# Altium project Juno_Light_Central.PrjPcb
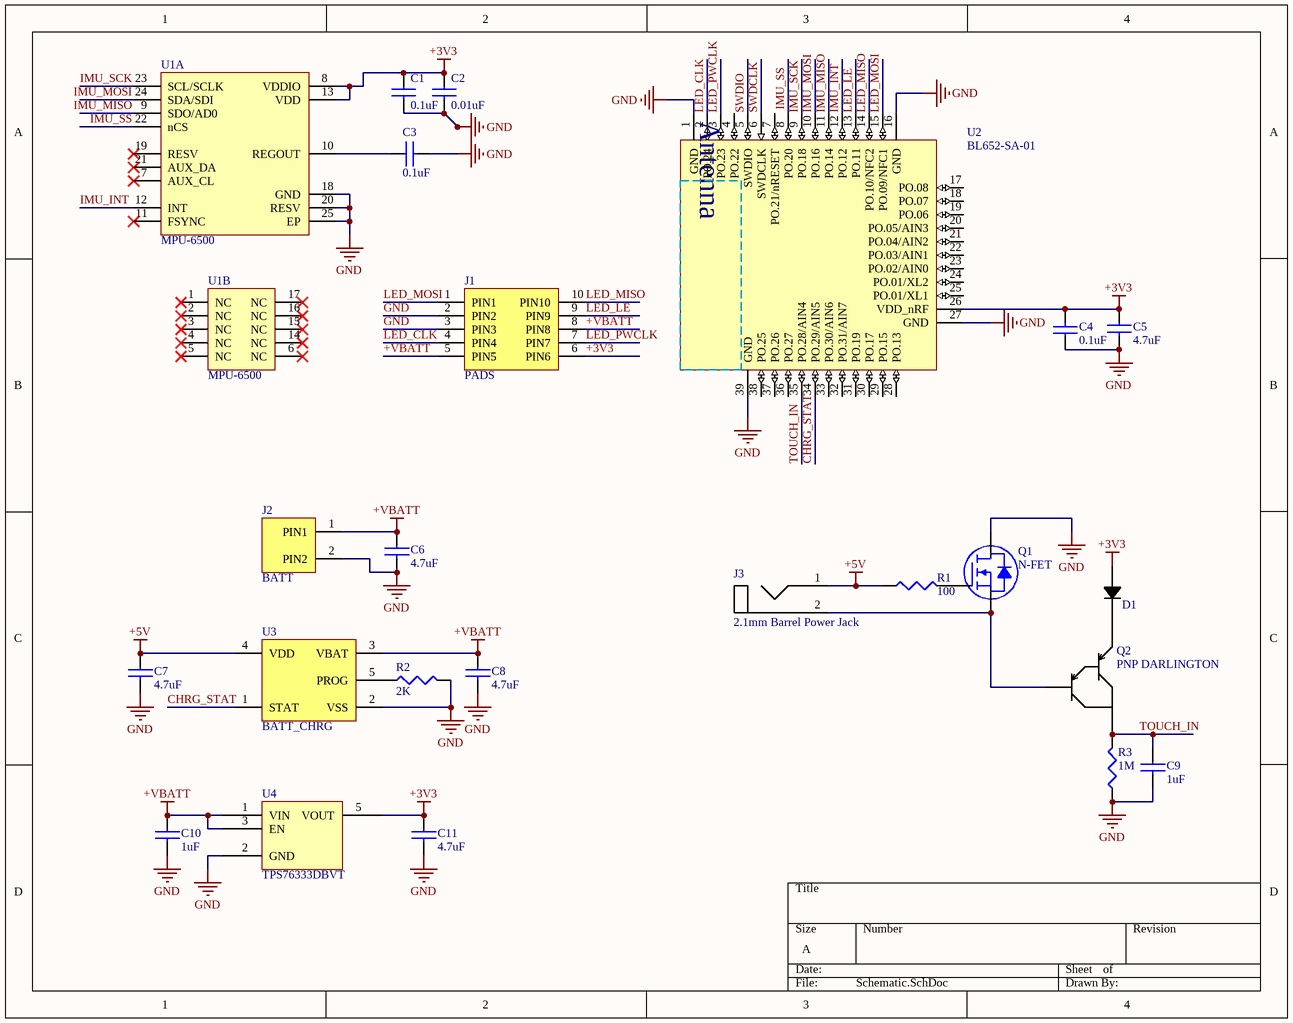
[diagram p0: Schematic.SchDoc]
1 sheet, 24 parts. Net scope: global (net labels, ports and power ports of the same name join across sheets).
Board file: Juno_Light_Central.PcbDoc

## Sheet Schematic.SchDoc
size A

### Parts
C1  0.1uF  [C0402]
C2  0.01uF  [C0402]
C3  0.1uF  [C0402]
C4  0.1uF  [C0402]
C5  4.7uF  [C0603]
C6  4.7uF  [C0603]
C7  4.7uF  [C0603]
C8  4.7uF  [C0603]
C9  1uF  [C0402]
C10  1uF  [C0402]
C11  4.7uF  [C0603]
D1  1N4148X-TP  [SOD-523]  (value not drawn)
J1  PADS  [Pads]
J2  BATT  [S2B-PH-K-S]
J3  2.1mm Barrel Power Jack  [2.1mm Power Jack]
Q1  N-FET  [SOT-23-3]
Q2  PNP DARLINGTON  [SOT-23-3]
R1  100  [R0402]
R2  2K  [R0402]
R3  1M  [R0402]
U1  MPU-6500  [QFN-24]  (parts A,B of 2)
U2  BL652-SA-01  [BL652-SA-01]
U3  BATT_CHRG  [SOT-23-5]
U4  TPS76333DBVT  [SOT-23-5]

### Nets
+3V3: C1.1 C2.1 C4.2 C5.1 C11.1 D1.2 J1.6(PIN6) U1.8(VDDIO) U1.13(VDD) U2.26(VDD_nRF) U4.5(VOUT)
+5V: C7.1 J3.1(+) R1.1 U3.4(VDD)
+VBATT: C6.1 C8.1 C10.1 J1.5(PIN5) J1.8(PIN8) J2.1(PIN1) U3.3(VBAT) U4.1(VIN) U4.3(EN)
GND: C1.2 C2.2 C3.2 C4.1 C5.2 C6.2 C7.2 C8.2 C9.2 C10.2 C11.2 J1.2(PIN2) J1.3(PIN3) J2.2(PIN2) Q1.3(D) R2.2 R3.1 U1.18(GND) U1.20(RESV) U1.25(EP) U2.1(GND) U2.16(GND) U2.27(GND) U2.39(GND) U3.2(VSS) U4.2(GND)
CHRG_STAT: U2.34(PO.29/AIN5) U3.1(STAT)
IMU_INT: U1.12(INT) U2.12(PO.12)
IMU_MISO: U1.9(SDO/AD0) U2.11(PO.14)
IMU_MOSI: U1.24(SDA/SDI) U2.10(PO.16)
IMU_SCK: U1.23(SCL/SCLK) U2.9(PO.18)
IMU_SS: U1.22(nCS) U2.8(PO.20)
LED_CLK: J1.4(PIN4) U2.2(PO.24)
LED_LE: J1.9(PIN9) U2.13(PO.11)
LED_MISO: J1.10(PIN10) U2.14(PO.10/NFC2)
LED_MOSI: J1.1(PIN1) U2.15(PO.09/NFC1)
LED_PWCLK: J1.7(PIN7) U2.3(PO.23)
SWDCLK: U2.6(SWDCLK)
SWDIO: U2.5(SWDIO)
TOUCH_IN: C9.1 Q2.3 R3.2 U2.35(PO.28/AIN4)
NetC3_1: C3.1 U1.10(REGOUT)
NetD1_1: D1.1 Q2.2
NetJ3_2: J3.2(+) Q1.2(S) Q2.1(B)
NetQ1_1: Q1.1(G) R1.2
NetR2_1: R2.1 U3.5(PROG)

Not connected (* = marked no-connect by the designer): U1 1(NC)* 2(NC)* 3(NC)* 4(NC)* 5(NC)* 6(NC)* 7(AUX_CL)* 11(FSYNC)* 14(NC)* 15(NC)* 16(NC)* 17(NC)* 19(RESV)* 21(AUX_DA)*; U2 4(PO.22) 7(PO.21/nRESET) 17(PO.08) 18(PO.07) 19(PO.06) 20(PO.05/AIN3) 21(PO.04/AIN2) 22(PO.03/AIN1) 23(PO.02/AIN0) 24(PO.01/XL2) 25(PO.01/XL1) 28(PO.13) 29(PO.15) 30(PO.17) 31(PO.19) 32(PO.31/AIN7) 33(PO.30/AIN6) 36(PO.27) 37(PO.26) 38(PO.25)

### Notes on the sheet
- (in symbol BL652-SA-01-T/R) Antenna

### Library data of the parts
C1 C3 C4 = CL05B104KO5NNNC: Cap Ceramic 0.1uF 16V X7R 10% SMD 0402 125C C/T; Manufacturer 1: Samsung; Description 1: Cap Ceramic 0.1uF 16V X7R 10% SMD 0402 125C Paper T/R; Capacitance: 100nF; Supplier 1: Digi-Key; Supplier Part Number 1: 1276-1001-6-ND; Manufacturer Part Number 1: CL05B104KO5NNNC; Stock 1: 9531; Pricing 1: 1=0.1, 10=0.018, 100=0.0081, 500=0.0058, 1000=0.0045, 2500=0.0041, 5000=0.0038 (USD); Mount: Surface Mount; Case/Package: 0402; Case Code (Metric): 1005; Case Code (Imperial): 0402; Material: Ceramic; Contact Plating: Tin; Min Operating Temperature: -55°C; Max Operating Temperature: 125°C; Tolerance: 10%; Package Quantity: 1; Packaging: Tape and Reel; Voltage Rating: 16V; Dielectric: X7R; Voltage: 16V; Voltage Rating (DC): 16V; Length: 1mm; Height: 0.5mm; Width: 0.02inch; Thickness: 0.022inch; Depth: 0.5mm; Radiation Hardening: No; Lead Free: Lead Free; ComponentLink1URL: https://datasheet.ciiva.com/16208/cl05b104kq5nnnc-16208343.pdf; ComponentLink1Description: https://datasheet.ciiva.com/16208/cl05b104kq5nnnc-16208343.pdf; ComponentLink2URL: https://datasheet.ciiva.com/26920/getdatasheetpartid-359683-26920169.pdf; ComponentLink2Description: https://datasheet.ciiva.com/26920/getdatasheetpartid-359683-26920169.pdf; ComponentLink3URL: https://datasheet.ciiva.com/26309/mlcc-catalogdownload2013-eng-26309003.pdf; ComponentLink3Description: https://datasheet.ciiva.com/26309/mlcc-catalogdownload2013-eng-26309003.pdf; ComponentLink4URL: https://datasheet.ciiva.com/29198/458718-da-01-en-vs-kondensator-0402-29198423.pdf; ComponentLink4Description: https://datasheet.ciiva.com/29198/458718-da-01-en-vs-kondensator-0402-29198423.pdf
C2 = GRM155R71E103KA01D: CAP CER 10000PF 25V X7R 0402; Manufacturer: Murata; Material: Ceramic; Capacitance: 10nF; Tolerance: 10%; Insulation Resistance: 10GR; Supplier 1: Digi-Key; Supplier Part Number 1: 490-1312-1-ND; Manufacturer Part Number: GRM155R71E103KA01D; Stock 1: 100000; Pricing 1: 1=0.1, 10=0.03, 100=0.0134, 500=0.00958, 1000=0.00753, 2500=0.00684, 5000=0.0063 (USD); Mount: Surface Mount; Case/Package: 0402; Number of Pins: 2; Case Code (Imperial): 0402; Case Code (Metric): 1005; Dielectric Material: Ceramic; Min Operating Temperature: -55°C; Max Operating Temperature: 125°C; Packaging: Tape and Reel; Voltage Rating: 25V; Voltage Rating (DC): 25V; Package Quantity: 1; Dielectric: X7R; Termination: SMD/SMT; Voltage: 25V; Length: 1mm; Height: 0.5mm; Width: 0.5mm; Thickness: 0.022inch; Depth: 0.5mm; Radiation Hardening: No; REACH SVHC: No SVHC; Lead Free: Lead Free; ComponentLink1URL: https://datasheet.ciiva.com/11786/0900766b807a1cab-11786320.pdf; ComponentLink1Description: https://datasheet.ciiva.com/11786/0900766b807a1cab-11786320.pdf; ComponentLink2URL: https://datasheet.ciiva.com/18184/getdatasheetpartid-161489-18184689.pdf; ComponentLink2Description: https://datasheet.ciiva.com/18184/getdatasheetpartid-161489-18184689.pdf; ComponentLink3URL: https://datasheet.ciiva.com/28534/1699889-28534148.pdf; ComponentLink3Description: https://datasheet.ciiva.com/28534/1699889-28534148.pdf; ComponentLink4URL: https://datasheet.ciiva.com/7937/1747448-7937621.pdf; ComponentLink4Description: https://datasheet.ciiva.com/7937/1747448-7937621.pdf; ComponentLink5URL: https://datasheet.ciiva.com/16199/product-16199034.pdf; ComponentLink5Description: https://datasheet.ciiva.com/16199/product-16199034.pdf; ComponentLink6URL: https://datasheet.ciiva.com/3777/3813grm155r71e103ka0123-3777115.pdf; ComponentLink6Description: https://datasheet.ciiva.com/3777/3813grm155r71e103ka0123-3777115.pdf; ComponentLink7URL: https://datasheet.ciiva.com/129/partnumbering-e-01-129741.pdf; ComponentLink7Description: https://datasheet.ciiva.com/129/partnumbering-e-01-129741.pdf; ComponentLink8URL: https://datasheet.ciiva.com/129/partnumbering-e-01-129742.pdf; ComponentLink8Description: https://datasheet.ciiva.com/129/partnumbering-e-01-129742.pdf; ComponentLink9URL: https://datasheet.ciiva.com/129/partnumbering-e-01-129743.pdf; ComponentLink9Description: https://datasheet.ciiva.com/129/partnumbering-e-01-129743.pdf; ComponentLink10URL: https://datasheet.ciiva.com/29199/454154-da-01-en-vs-kondensator-0402-29199817.pdf; ComponentLink10Description: https://datasheet.ciiva.com/29199/454154-da-01-en-vs-kondensator-0402-29199817.pdf
C5-C8 C11 = CC0603KRX5R6BB475: 4.7µF ±10% 10V X5R Ceramic Capacitor -55°C ~ 85°C Surface Mount, MLCC 0603 (1608 Metric) 0.063" L x 0.031" W (1.60mm x 0.80mm); Manufacturer 1: Yageo; Supplier 1: Digi-Key; Supplier Part Number 1: 311-1455-6-ND; Manufacturer Part Number 1: CC0603KRX5R6BB475; Description 1: 4.7µF ±10% 10V X5R Ceramic Capacitor -55°C ~ 85°C Surface Mount, MLCC 0603 (1608 Metric) 0.063" L x 0.031" W (1.60mm x 0.80mm); Stock 1: 166715; Pricing 1: 1=0.16, 10=0.115, 100=0.0543, 500=0.0381, 1000=0.0315 (USD); Mount: Surface Mount; Case/Package: 0603; Case Code (Imperial): 0603; Case Code (Metric): 1608; Min Operating Temperature: -55°C; Max Operating Temperature: 85°C; Capacitance: 4.7uF; Voltage Rating: 10V; Voltage Rating (DC): 10V; Tolerance: 10%; Packaging: Tape and Reel; Package Quantity: 1; Dielectric: X5R; Termination: SMD/SMT; Composition: Ceramic; Length: 1.6mm; Height: 0.8mm; Width: 0.8mm; Thickness: 0.035inch; Depth: 0.8mm; Radiation Hardening: No; REACH SVHC: Unknown; Lead Free: Lead Free; Halogen Free: Halogen Free; ComponentLink1URL: https://datasheet.ciiva.com/8033/1525783-8033798.pdf; ComponentLink1Description: https://datasheet.ciiva.com/8033/1525783-8033798.pdf; ComponentLink2URL: https://datasheet.ciiva.com/179/mlccorderingcode-179704.pdf; ComponentLink2Description: https://datasheet.ciiva.com/179/mlccorderingcode-179704.pdf; ComponentLink3URL: https://datasheet.ciiva.com/179/mlccorderingcode-179705.pdf; ComponentLink3Description: https://datasheet.ciiva.com/179/mlccorderingcode-179705.pdf; ComponentLink4URL: https://datasheet.ciiva.com/179/mlccorderingcode-179706.pdf; ComponentLink4Description: https://datasheet.ciiva.com/179/mlccorderingcode-179706.pdf; ComponentLink5URL: https://datasheet.ciiva.com/8033/1525783-8033802.pdf; ComponentLink5Description: https://datasheet.ciiva.com/8033/1525783-8033802.pdf; ComponentLink6URL: https://datasheet.ciiva.com/11586/upy-gphc-x5r-4v-to-50v-12-11586314.pdf; ComponentLink6Description: https://datasheet.ciiva.com/11586/upy-gphc-x5r-4v-to-50v-12-11586314.pdf; ComponentLink7URL: https://datasheet.ciiva.com/16623/upy-gphc-x5r-4v-to-50v-12-16623983.pdf; ComponentLink7Description: https://datasheet.ciiva.com/16623/upy-gphc-x5r-4v-to-50v-12-16623983.pdf
C9 C10 = CL05A105MP5NNNC: Cap Ceramic 1uF 10V X5R 20% SMD 0402 85C C/T; Manufacturer 1: Samsung; Description 1: Cap Ceramic 1uF 10V X5R 20% SMD 0402 85C Paper T/R; Supplier 1: Digi-Key; Supplier Part Number 1: 1276-1448-6-ND; Manufacturer Part Number 1: CL05A105MP5NNNC; Stock 1: 42775; Pricing 1: 1=0.1, 10=0.028, 100=0.0124, 500=0.0089, 1000=0.007, 2500=0.0063, 5000=0.0058 (USD); Mount: Surface Mount; Case/Package: 0402; Case Code (Metric): 1005; Case Code (Imperial): 0402; Min Operating Temperature: -55°C; Max Operating Temperature: 85°C; Package Quantity: 1; Packaging: Tape and Reel; Capacitance: 1uF; Tolerance: 20%; Voltage Rating: 10V; Dielectric: X5R; Voltage Rating (DC): 10V; Length: 1mm; Height: 0.5mm; Width: 0.02inch; Thickness: 0.022inch; Depth: 0.5mm; Radiation Hardening: No; Lead Free: Lead Free; ComponentLink1URL: https://datasheet.ciiva.com/25802/cl05a105mp5nnnc-25802049.pdf; ComponentLink1Description: https://datasheet.ciiva.com/25802/cl05a105mp5nnnc-25802049.pdf
D1 = 1N4148X-TP: Manufacturer 1: MCC; Max Surge Current: 2A; Recovery Time: 4ns; Forward Voltage: 1.25V; Forward Current: 300mA; Average Rectified Current: 150mA; Max Reverse Leakage Current: 1uA; Power Dissipation: 200mW; Max Repetitive Reverse Voltage (Vrrm): 100V; Element Configuration: Single; Polarity: Standard; Voltage Rating (DC): 75V; Capacitance: 2pF; Supplier 1: Digi-Key; Supplier Part Number 1: 1N4148XTPMSCT-ND; Manufacturer Part Number 1: 1N4148X-TP; Stock 1: 2136057; Pricing 1: 1=0.14, 10=0.125, 100=0.0815, 500=0.03986, 1000=0.02718 (USD); Mount: Surface Mount; Number of Pins: 2; Min Operating Temperature: -65°C; Max Operating Temperature: 150°C; Package Quantity: 1; Packaging: Tape and Reel; Reverse Recovery Time: 4ns; Peak Non-Repetitive Surge Current: 2A; Current Rating: 150mA; Output Current: 300mA; Max Reverse Voltage (DC): 75V; Radiation Hardening: No; Lead Free: Lead Free; ComponentLink1URL: http://www.mccsemi.com/up_pdf/1N4148X(SOD-523).PDF?src-supplier=Digi-Key; ComponentLink1Description: http://www.mccsemi.com/up_pdf/1N4148X(SOD-523).PDF?src-supplier=Digi-Key; ComponentLink2URL: http://www.mouser.com/ds/2/258/1N4148X(SOD-523)-349105.pdf?src-supplier=Mouser; ComponentLink2Description: http://www.mouser.com/ds/2/258/1N4148X(SOD-523)-349105.pdf?src-supplier=Mouser; ComponentLink3URL: http://www.mccsemi.com/up_pdf/1N4148X(SOD-523).PDF?src-supplier=Future+Electronics; ComponentLink3Description: http://www.mccsemi.com/up_pdf/1N4148X(SOD-523).PDF?src-supplier=Future+Electronics
J2 = S2B-PH-K-S(LF)(SN): CONN HEADER R/A 2POS 2MM; Manufacturer 1: JST; Current Rating: 2A; Contact Resistance: 20mR; Voltage Rating: 100V; Number of Positions: 2; Gender: Male; Connector Type: Male Pin; Insulation Resistance: 1GR; Supplier 1: Digi-Key; Supplier Part Number 1: 455-1719-ND; Manufacturer Part Number 1: S2B-PH-K-S(LF)(SN); Stock 1: 161668; Pricing 1: 1=0.17, 10=0.161, 100=0.0991, 500=0.08202, 1000=0.07177, 5000=0.06152, 10000=0.05981 (USD); Mount: Through Hole; Number of Pins: 2; Contact Material: Tin,Brass,Bronze; Contact Plating: Tin,Copper; Color: Natural,White; Housing Color: White; Housing Material: Polyamide; Min Operating Temperature: -25°C; Max Operating Temperature: 85°C; Max Current Rating: 2A; Number of Rows: 1; Packaging: Bulk; Termination: Solder; Fastening Type: Detent; Number of Contacts: 2; Max Voltage Rating (AC): 100V; Orientation: Right Angle; Number of Poles: 2; Voltage Rating (AC): 100V; Max Voltage Rating (DC): 100V; Working Voltage: 100V; Length: 5.9mm; Height: 9.4mm; Pitch: 2mm; Width: 4.5mm; Contact Mating Length: 0.13inch; Depth: 7.6mm; Lead Pitch: 2mm; REACH SVHC: No SVHC; Lead Free: Lead Free; Flammability Rating: UL94 V-0; ComponentLink1URL: http://www1.futureelectronics.com/doc/JST/S2B-PH-K-S(LF)(SN).pdf?src-supplier=Future+Electronics; ComponentLink1Description: http://www1.futureelectronics.com/doc/JST/S2B-PH-K-S(LF)(SN).pdf?src-supplier=Future+Electronics; ComponentLink2URL: https://www.verical.com/server-webapp/html/getDatasheet?partID=641020&src-supplier=Verical; ComponentLink2Description: https://www.verical.com/server-webapp/html/getDatasheet?partID=641020&src-supplier=Verical; ComponentLink3URL: http://www.jst-mfg.com/product/pdf/eng/ePH.pdf?src-supplier=Digi-Key; ComponentLink3Description: http://www.jst-mfg.com/product/pdf/eng/ePH.pdf?src-supplier=Digi-Key; ComponentLink4URL: http://www.farnell.com/datasheets/80564.pdf?src-supplier=Element14; ComponentLink4Description: http://www.farnell.com/datasheets/80564.pdf?src-supplier=Element14
J3 = 2.1mm Barrel Power Jack: 2.1mm Barrel Power Jack Panel Mount
Q1 = NDS331N: MOSFET N-CH 20V 1.3A SSOT3; Manufacturer 1: ON Semiconductor / Fairchild; Nominal Vgs: 700mV; Rds On Max: 160mR; Input Capacitance: 162pF; Rise Time: 25ns; Max Power Dissipation: 500mW; Number of Elements: 1; Gate to Source Voltage (Vgs): 8V; Fall Time: 5ns; Drain to Source Resistance: 210mR; Turn-Off Delay Time: 10ns; Element Configuration: Single; Supplier 1: Digi-Key; Supplier Part Number 1: NDS331NCT-ND; Manufacturer Part Number 1: NDS331N; Stock 1: 114658; Pricing 1: 1=0.44, 10=0.349, 100=0.2395, 500=0.16424, 1000=0.12318 (USD); Mount: Surface Mount; Case/Package: TO-236-3; Number of Pins: 3; Weight: 0.03g; Min Operating Temperature: -55°C; Max Operating Temperature: 150°C; Package Quantity: 1; Packaging: Tape and Reel; Drain to Source Voltage (Vdss): 20V; Continuous Drain Current (ID): 1.3A; Drain to Source Breakdown Voltage: 20V; Power Dissipation: 500mW; Threshold Voltage: 700mV; Turn-On Delay Time: 5ns; Voltage Rating (DC): 20V; Current Rating: 1.3A; On-State Resistance: 160mR; Length: 2.92mm; Height: 0.94mm; Width: 1.4mm; Radiation Hardening: No; REACH SVHC: No SVHC; Lead Free: Lead Free; ComponentLink1URL: http://www.farnell.com/datasheets/2303897.pdf?src-supplier=Newark; ComponentLink1Description: http://www.farnell.com/datasheets/2303897.pdf?src-supplier=Newark; ComponentLink2URL: http://www.farnell.com/datasheets/195775.pdf?src-supplier=Element14; ComponentLink2Description: http://www.farnell.com/datasheets/195775.pdf?src-supplier=Element14; ComponentLink3URL: https://www.verical.com/server-webapp/html/getDatasheet?partID=110520&src-supplier=Verical; ComponentLink3Description: https://www.verical.com/server-webapp/html/getDatasheet?partID=110520&src-supplier=Verical; ComponentLink4URL: http://www.jameco.com/Jameco/Products/ProdDS/1030703.pdf?src-supplier=Jameco; ComponentLink4Description: http://www.jameco.com/Jameco/Products/ProdDS/1030703.pdf?src-supplier=Jameco; ComponentLink5URL: http://www.mouser.com/ds/2/149/NDS331N-116501.pdf?src-supplier=Mouser; ComponentLink5Description: http://www.mouser.com/ds/2/149/NDS331N-116501.pdf?src-supplier=Mouser; ComponentLink6URL: https://www.fairchildsemi.com/datasheets/ND/NDS331N.pdf?src-supplier=Avnet; ComponentLink6Description: https://www.fairchildsemi.com/datasheets/ND/NDS331N.pdf?src-supplier=Avnet; ComponentLink7URL: http://www.fairchildsemi.com/ds/ND/NDS331N.pdf?src-supplier=Avnet+Europe; ComponentLink7Description: http://www.fairchildsemi.com/ds/ND/NDS331N.pdf?src-supplier=Avnet+Europe
Q2 = MMBTA63LT1G: Manufacturer 1: ON Semiconductor; Collector Emitter Voltage (VCEO): 30V; hFE Min: 5000; Number of Elements: 1; Max Power Dissipation: 225mW; Max Collector Current: 500mA; Transition Frequency: 125MHz; Emitter Base Voltage (VEBO): 10V; Collector Emitter Saturation Voltage: 1.5V; Element Configuration: Single; Continuous Collector Current: -500mA; Voltage Rating (DC): -30V; Supplier 1: Digi-Key; Supplier Part Number 1: MMBTA63LT1GOSCT-ND; Manufacturer Part Number 1: MMBTA63LT1G; Stock 1: 102027; Pricing 1: 1=0.22, 10=0.203, 100=0.1106, 500=0.06806, 1000=0.0464 (USD); Case/Package: SOT-23-3; Number of Pins: 3; Weight: 0.01lb; Contact Plating: Tin,Matte; Min Operating Temperature: -55°C; Max Operating Temperature: 150°C; Package Quantity: 1; Packaging: Tape and Reel; Collector Emitter Breakdown Voltage: 30V; Max Breakdown Voltage: 30V; Polarity: PNP; Collector Base Voltage (VCBO): 30V; Power Dissipation: 225mW; Current Rating: -500mA; Length: 3.04mm; Height: 1.01mm; Width: 1.4mm; Radiation Hardening: No; REACH SVHC: No SVHC; Lead Free: Lead Free; Halogen Free: Halogen Free; ComponentLink1URL: http://www.onsemi.com/pub/Collateral/MMBTA63LT1-D.PDF?src-supplier=Avnet; ComponentLink1Description: http://www.onsemi.com/pub/Collateral/MMBTA63LT1-D.PDF?src-supplier=Avnet; ComponentLink2URL: http://www.onsemi.com/pub/Collateral/MMBTA63LT1-D.PDF?src-supplier=Digi-Key; ComponentLink2Description: http://www.onsemi.com/pub/Collateral/MMBTA63LT1-D.PDF?src-supplier=Digi-Key; ComponentLink3URL: http://www.onsemi.com/pub/Collateral/MMBTA63LT1-D.PDF?src-supplier=Future+Electronics; ComponentLink3Description: http://www.onsemi.com/pub/Collateral/MMBTA63LT1-D.PDF?src-supplier=Future+Electronics; ComponentLink4URL: http://www.jameco.com/Jameco/Products/ProdDS/2011408.pdf?src-supplier=Jameco; ComponentLink4Description: http://www.jameco.com/Jameco/Products/ProdDS/2011408.pdf?src-supplier=Jameco
R1 = ERJ-2GEJ101X: Res Thick Film 0402 100 Ohm 5% 0.1W(1/10W) ±200ppm/C Molded SMD Automotive T/R; Manufacturer 1: Panasonic ECG; Resistance: 100R; Temperature Coefficient: 200ppm/°C; Power Rating: 100mW; Voltage Rating: 50V; Supplier 1: Digi-Key; Supplier Part Number 1: P100JDKR-ND; Manufacturer Part Number 1: ERJ-2GEJ101X; Description 1: Res Thick Film 0402 100 Ohm 5% 0.1W(1/10W) ±200ppm/C Molded SMD Automotive T/R; Stock 1: 1981514; Pricing 1: 1=0.1, 10=0.029, 100=0.0117, 1000=0.0053, 2500=0.0046, 5000=0.0038 (USD); Mount: Surface Mount; Case/Package: 0402; Contact Plating: Tin; Case Code (Imperial): 0402; Case Code (Metric): 1005; Min Operating Temperature: -55°C; Max Operating Temperature: 155°C; Tolerance: 5%; Composition: Thick Film; Packaging: Cut Tape; Package Quantity: 1; Termination: SMD/SMT; Number of Terminations: 2; Military Standard: Not; Max Power Dissipation: 100mW; Voltage Rating (DC): 50V; Length: 1mm; Height: 0.35mm; Depth: 0.5mm; Width: 0.5mm; Radiation Hardening: No; REACH SVHC: No SVHC; Lead Free: Lead Free; ComponentLink1URL: https://datasheet.ciiva.com/11821/0900766b80f806dd-11821172.pdf; ComponentLink1Description: https://datasheet.ciiva.com/11821/0900766b80f806dd-11821172.pdf; ComponentLink2URL: https://datasheet.ciiva.com/16767/70260739-16767557.pdf; ComponentLink2Description: https://datasheet.ciiva.com/16767/70260739-16767557.pdf; ComponentLink3URL: https://datasheet.ciiva.com/48531/aoa0000ce1-48531079.pdf; ComponentLink3Description: https://datasheet.ciiva.com/48531/aoa0000ce1-48531079.pdf; ComponentLink4URL: https://datasheet.ciiva.com/16511/aoa0000ce1-16511417.pdf; ComponentLink4Description: https://datasheet.ciiva.com/16511/aoa0000ce1-16511417.pdf; ComponentLink5URL: https://datasheet.ciiva.com/16777/70260739-16777609.pdf; ComponentLink5Description: https://datasheet.ciiva.com/16777/70260739-16777609.pdf; ComponentLink6URL: https://datasheet.ciiva.com/9186/aoa0000ce1-9186682.pdf; ComponentLink6Description: https://datasheet.ciiva.com/9186/aoa0000ce1-9186682.pdf; ComponentLink7URL: https://datasheet.ciiva.com/17207/aoa0000ce1-17207978.pdf; ComponentLink7Description: https://datasheet.ciiva.com/17207/aoa0000ce1-17207978.pdf; ComponentLink8URL: https://datasheet.ciiva.com/30133/4aoa0000ce1-30133884.pdf; ComponentLink8Description: https://datasheet.ciiva.com/30133/4aoa0000ce1-30133884.pdf; ComponentLink9URL: https://datasheet.ciiva.com/46389/1500035-46389644.pdf; ComponentLink9Description: https://datasheet.ciiva.com/46389/1500035-46389644.pdf; ComponentLink10URL: https://datasheet.ciiva.com/43460/1500035-43460365.pdf; ComponentLink10Description: https://datasheet.ciiva.com/43460/1500035-43460365.pdf
R2 = ERJ2RKF2001X: RES SMD 2K OHM 1% 1/10W 0402; Manufacturer 1: Panasonic; Resistance: 2kR; Power Rating: 100mW; Voltage Rating: 50V; Temperature Coefficient: 100ppm/°C; Supplier 1: Digi-Key; Supplier Part Number 1: P2.00KLCT-ND; Manufacturer Part Number 1: ERJ2RKF2001X; Stock 1: 3588028; Pricing 1: 1=0.1, 10=0.045, 100=0.0183, 1000=0.00823, 2500=0.00715, 5000=0.0059 (USD); Mount: Surface Mount; Case/Package: 0402; Case Code (Metric): 1005; Case Code (Imperial): 0402; Contact Plating: Tin; Min Operating Temperature: -55°C; Max Operating Temperature: 155°C; Packaging: Tape and Reel; Tolerance: 1%; Package Quantity: 10000; Composition: Thick Film; Number of Terminations: 2; Termination: SMD/SMT; Military Standard: Not; Max Power Dissipation: 100mW; Voltage Rating (DC): 50V; Working Voltage: 50V; Features: Automotive AEC-Q200; Length: 1mm; Height: 0.35mm; Width: 0.02inch; Depth: 0.5mm; Radiation Hardening: No; REACH SVHC: No SVHC; Lead Free: Lead Free; ComponentLink1URL: http://www.farnell.com/datasheets/1678782.pdf?src-supplier=Element14; ComponentLink1Description: http://www.farnell.com/datasheets/1678782.pdf?src-supplier=Element14; ComponentLink2URL: https://industrial.panasonic.com/cdbs/www-data/pdf/RDA0000/DMA0000COL11.pdf?src-supplier=Avnet; ComponentLink2Description: https://industrial.panasonic.com/cdbs/www-data/pdf/RDA0000/DMA0000COL11.pdf?src-supplier=Avnet; ComponentLink3URL: https://industrial.panasonic.com/cdbs/www-data/pdf/RDA0000/AOA0000C304.pdf?src-supplier=Future+Electronics; ComponentLink3Description: https://industrial.panasonic.com/cdbs/www-data/pdf/RDA0000/AOA0000C304.pdf?src-supplier=Future+Electronics; ComponentLink4URL: http://www.farnell.com/datasheets/1911175.pdf?src-supplier=Farnell; ComponentLink4Description: http://www.farnell.com/datasheets/1911175.pdf?src-supplier=Farnell; ComponentLink5URL: http://www.farnell.com/datasheets/426256.pdf?src-supplier=Element14; ComponentLink5Description: http://www.farnell.com/datasheets/426256.pdf?src-supplier=Element14; ComponentLink6URL: http://industrial.panasonic.com/www-data/pdf/AOA0000/AOA0000CE2.pdf?src-supplier=Avnet+Asia; ComponentLink6Description: http://industrial.panasonic.com/www-data/pdf/AOA0000/AOA0000CE2.pdf?src-supplier=Avnet+Asia; ComponentLink7URL: http://www.alliedelec.com/m/d/623f45ff1957d936ff56d46fd1c28cac.pdf?src-supplier=Allied+Electronics; ComponentLink7Description: http://www.alliedelec.com/m/d/623f45ff1957d936ff56d46fd1c28cac.pdf?src-supplier=Allied+Electronics; ComponentLink8URL: http://www.mouser.com/ds/2/315/AOA0000CE2-37512.pdf?src-supplier=Mouser; ComponentLink8Description: http://www.mouser.com/ds/2/315/AOA0000CE2-37512.pdf?src-supplier=Mouser; ComponentLink9URL: http://industrial.panasonic.com/www-data/pdf/AOA0000/AOA0000CE2.pdf?src-supplier=Avnet; ComponentLink9Description: http://industrial.panasonic.com/www-data/pdf/AOA0000/AOA0000CE2.pdf?src-supplier=Avnet
R3 = RC0402JR-071ML: Manufacturer 1: Yageo; Resistance: 1MR; Power Rating: 62.5mW; Tolerance: 5%; Voltage Rating: 50V; Temperature Coefficient: 100ppm/°C; Max Power Dissipation: 63mW; Supplier 1: Digi-Key; Supplier Part Number 1: 311-1.0MJRCT-ND; Manufacturer Part Number 1: RC0402JR-071ML; Stock 1: 2904136; Pricing 1: 1=0.1, 10=0.013, 100=0.0055, 1000=0.00245, 2500=0.00212, 5000=0.00176 (USD); Case/Package: 0402; Weight: 2.3E-05oz; Case Code (Metric): 1005; Case Code (Imperial): 0402; Min Operating Temperature: -55°C; Max Operating Temperature: 155°C; Composition: Thick Film; Package Quantity: 1; Packaging: Tape and Reel; Number of Terminations: 2; Termination: SMD/SMT; Military Standard: Not; Features: Moisture Resistant; Length: 1mm; Height: 0.016inch; Width: 0.02inch; Depth: 0.5mm; REACH SVHC: No SVHC; Lead Free: Lead Free; ComponentLink1URL: http://www.yageo.com/documents/recent/PYu-RC_Group_51_RoHS_L_10.pdf?src-supplier=Digi-Key; ComponentLink1Description: http://www.yageo.com/documents/recent/PYu-RC_Group_51_RoHS_L_10.pdf?src-supplier=Digi-Key; ComponentLink2URL: http://www.farnell.com/datasheets/1018594.pdf?src-supplier=Element14; ComponentLink2Description: http://www.farnell.com/datasheets/1018594.pdf?src-supplier=Element14; ComponentLink3URL: http://www.yageo.com/documents/recent/PYu-RC_Group_51_RoHS_L_9.pdf?src-supplier=Mouser; ComponentLink3Description: http://www.yageo.com/documents/recent/PYu-RC_Group_51_RoHS_L_9.pdf?src-supplier=Mouser; ComponentLink4URL: http://www.yageo.com/documents/recent/PYu-RC0402_51_RoHS_L_6_r.pdf?src-supplier=Future+Electronics; ComponentLink4Description: http://www.yageo.com/documents/recent/PYu-RC0402_51_RoHS_L_6_r.pdf?src-supplier=Future+Electronics
U1 = MPU-6500: GYRO/ACCELEROMETER 6AXIS 24QFN; Manufacturer: TDK InvenSense; Sensor Type: Accelerometer,Gyroscope; Output Type: Digital; Operating Supply Voltage: 3.45V; Supplier 1: Digi-Key; Supplier Part Number 1: 1428-1011-1-ND; Manufacturer Part Number: MPU-6500; Stock 1: 29119; Pricing 1: 1=8.31, 5=7.288, 10=6.559, 25=5.83, 50=5.3928, 100=4.664, 500=4.3725, 1000=4.081 (USD); Mount: Surface Mount; Case/Package: QFN; Number of Pins: 24; Min Operating Temperature: -40°C; Max Operating Temperature: 85°C; Package Quantity: 5000; ComponentLink1URL: http://store.invensense.com/Datasheets/invensense/RM-MPU-6500A-00.pdf; ComponentLink1Description: http://store.invensense.com/Datasheets/invensense/RM-MPU-6500A-00.pdf
U2 = BL652-SA-01-T/R: Manufacturer: Laird; Supplier 1: Digi-Key; Supplier Part Number 1: BL652-SA-01-CT-ND; Manufacturer Part Number: BL652-SA-01-T/R; Stock: 7566; Pricing: 1=7.45 (USD); Case/Package: Module
U3 = MCP73831T-2ACI/OT: Manufacturer 1: Microchip; Number of Cells: 1; Output Voltage: 4.2V; Max Supply Voltage: 6V; Min Supply Voltage: 3.75V; Output Current: 500mA; Max Output Voltage: 4.5V; Min Output Voltage: 4.168V; Max Power Dissipation: 1.54W; Drain to Source Resistance: 350mR; Voltage Rating: 4.534V; Supplier 1: Digi-Key; Supplier Part Number 1: MCP73831T-2ACI/OTCT-ND; Manufacturer Part Number 1: MCP73831T-2ACI/OT; Stock 1: 48482; Pricing 1: 1=0.58, 25=0.484, 100=0.4326 (USD); Mount: Surface Mount; Case/Package: SOT-23; Number of Pins: 5; Weight: 0.00709oz; Contact Plating: Tin,Matte; Min Operating Temperature: -40°C; Max Operating Temperature: 85°C; Packaging: Tape and Reel; Max Charge Current: 500mA; Max Input Voltage: 6V; Number of Outputs: 1; Number of Channels: 1; Termination: SMD/SMT; Length: 0.122inch; Height: 0.051inch; Width: 0.071inch; Radiation Hardening: No; REACH SVHC: No SVHC; Lead Free: Lead Free; ComponentLink1URL: http://www.microchip.com/mymicrochip/filehandler.aspx?ddocname=en023833&src-supplier=Digi-Key; ComponentLink1Description: http://www.microchip.com/mymicrochip/filehandler.aspx?ddocname=en023833&src-supplier=Digi-Key; ComponentLink2URL: http://www.farnell.com/datasheets/630369.pdf?src-supplier=Element14; ComponentLink2Description: http://www.farnell.com/datasheets/630369.pdf?src-supplier=Element14; ComponentLink3URL: http://www.farnell.com/datasheets/2124927.pdf?src-supplier=Element14; ComponentLink3Description: http://www.farnell.com/datasheets/2124927.pdf?src-supplier=Element14; ComponentLink4URL: http://ww1.microchip.com/downloads/en/DeviceDoc/21984e.pdf?src-supplier=Avnet; ComponentLink4Description: http://ww1.microchip.com/downloads/en/DeviceDoc/21984e.pdf?src-supplier=Avnet; ComponentLink5URL: http://www.farnell.com/datasheets/2124927.pdf?src-supplier=Newark; ComponentLink5Description: http://www.farnell.com/datasheets/2124927.pdf?src-supplier=Newark; ComponentLink6URL: http://www.microchip.com/mymicrochip/filehandler.aspx?ddocname=en025112&src-supplier=Future+Electronics; ComponentLink6Description: http://www.microchip.com/mymicrochip/filehandler.aspx?ddocname=en025112&src-supplier=Future+Electronics; ComponentLink7URL: http://www.produktinfo.conrad.com/datenblaetter/650000-674999/651521-da-01-en-CONTR__MCP73831T_2ACI_OT_SOT_23_5_MCP.pdf?src-supplier=Conrad; ComponentLink7Description: http://www.produktinfo.conrad.com/datenblaetter/650000-674999/651521-da-01-en-CONTR__MCP73831T_2ACI_OT_SOT_23_5_MCP.pdf?src-supplier=Conrad
U4 = TPS76333DBVT: IC REG LDO 3.3V 0.15A SOT23-5; Manufacturer 1: Texas Instruments; Output Current: 150mA; Max Power Dissipation: 555mW; Max Supply Voltage: 10V; Min Supply Voltage: 2.7V; Input Bias Current: 85uA; Dropout Voltage: 300mV; Number of Outputs: 1; Min Current Limit: 500mA; Polarity: Positive; Quiescent Current: 80uA; Output Voltage Accuracy: 3%; Supplier 1: Digi-Key; Supplier Part Number 1: 296-2705-6-ND; Manufacturer Part Number 1: TPS76333DBVT; Description 1: IC REG LDO 3.3V 0.15A SOT23-5; Stock 1: 3719; Pricing 1: 1=0.96, 10=0.857, 100=0.6681 (USD); Case/Package: SOT-23; Number of Pins: 5; Contact Plating: Gold; Min Operating Temperature: -40°C; Max Operating Temperature: 125°C; Package Quantity: 1; Packaging: Tape and Reel; Power Dissipation: 555mW; Output Voltage: 3.3V; Power Rating: 555mW; Nominal Output Voltage: 3.3V; Max Output Current: 150mA; Max Input Voltage: 10V; Min Input Voltage: 2.7V; Number of Regulators: 1; Min Output Voltage: 3.3V; Max Output Voltage: 3.3V; Termination: SMD/SMT; Voltage: 3.3V; Accuracy: 3%; Current Rating: 150mA; Length: 2.9mm; Height: 1.15mm; Width: 1.6mm; Radiation Hardening: No; REACH SVHC: No SVHC; Lead Free: Lead Free; ComponentLink1URL: https://datasheet.ciiva.com/30507/tps76333dbvt-30507683.pdf; ComponentLink1Description: https://datasheet.ciiva.com/30507/tps76333dbvt-30507683.pdf; ComponentLink2URL: https://datasheet.ciiva.com/25626/0900766b8062816d-25626741.pdf; ComponentLink2Description: https://datasheet.ciiva.com/25626/0900766b8062816d-25626741.pdf; ComponentLink3URL: https://datasheet.ciiva.com/46390/1882045-46390261.pdf; ComponentLink3Description: https://datasheet.ciiva.com/46390/1882045-46390261.pdf; ComponentLink4URL: https://datasheet.ciiva.com/27049/763729-27049869.pdf; ComponentLink4Description: https://datasheet.ciiva.com/27049/763729-27049869.pdf; ComponentLink5URL: https://datasheet.ciiva.com/41462/001015062-da-01-en-ic-reg-ldo-3-3v-0-tps76333dbvt-sot-5-tid-41462909.pdf; ComponentLink5Description: https://datasheet.ciiva.com/41462/001015062-da-01-en-ic-reg-ldo-3-3v-0-tps76333dbvt-sot-5-tid-41462909.pdf; ComponentLink6URL: https://datasheet.ciiva.com/26904/tps76333dbvt-26904174.pdf; ComponentLink6Description: https://datasheet.ciiva.com/26904/tps76333dbvt-26904174.pdf